# EasyEDA Pro project ayabinterfacev2.epro

# Board PCB1
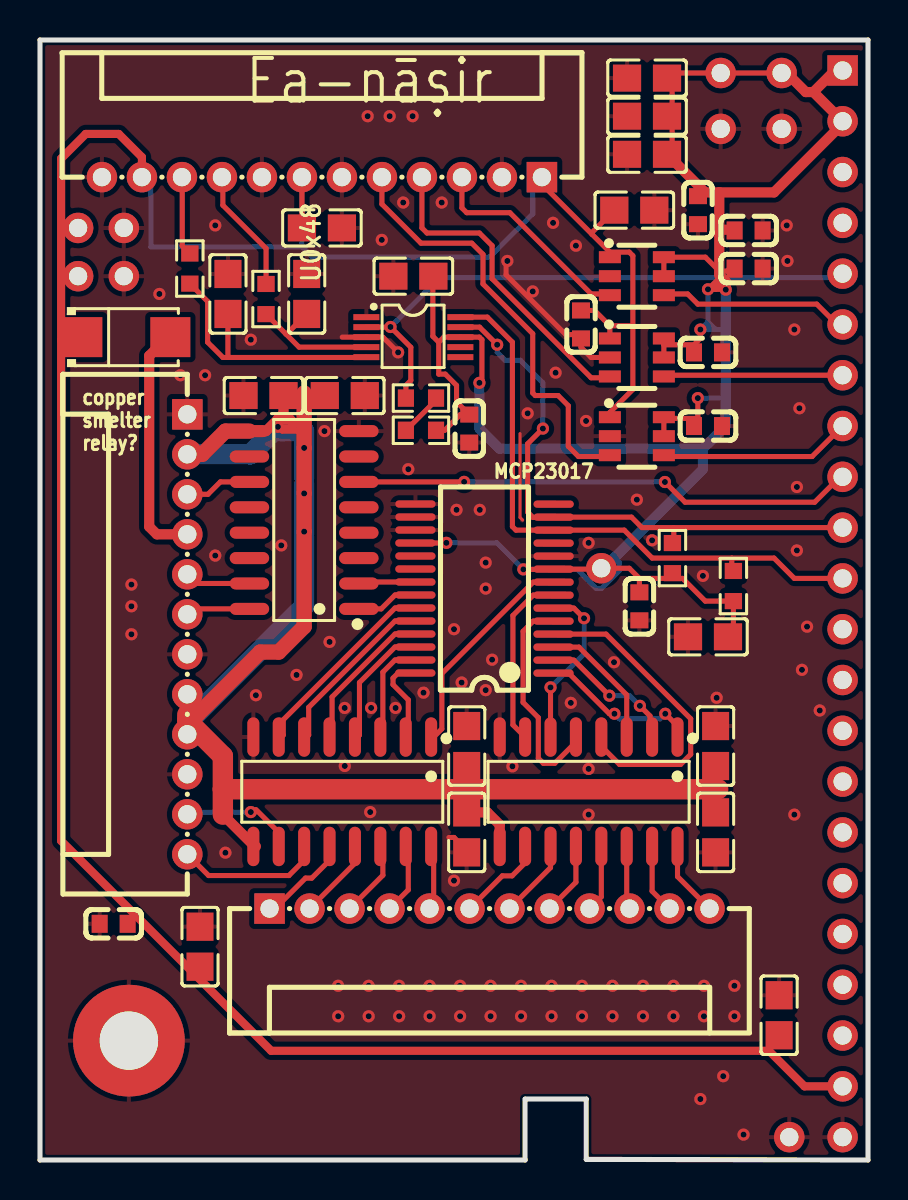
[diagram p0: board, top side]
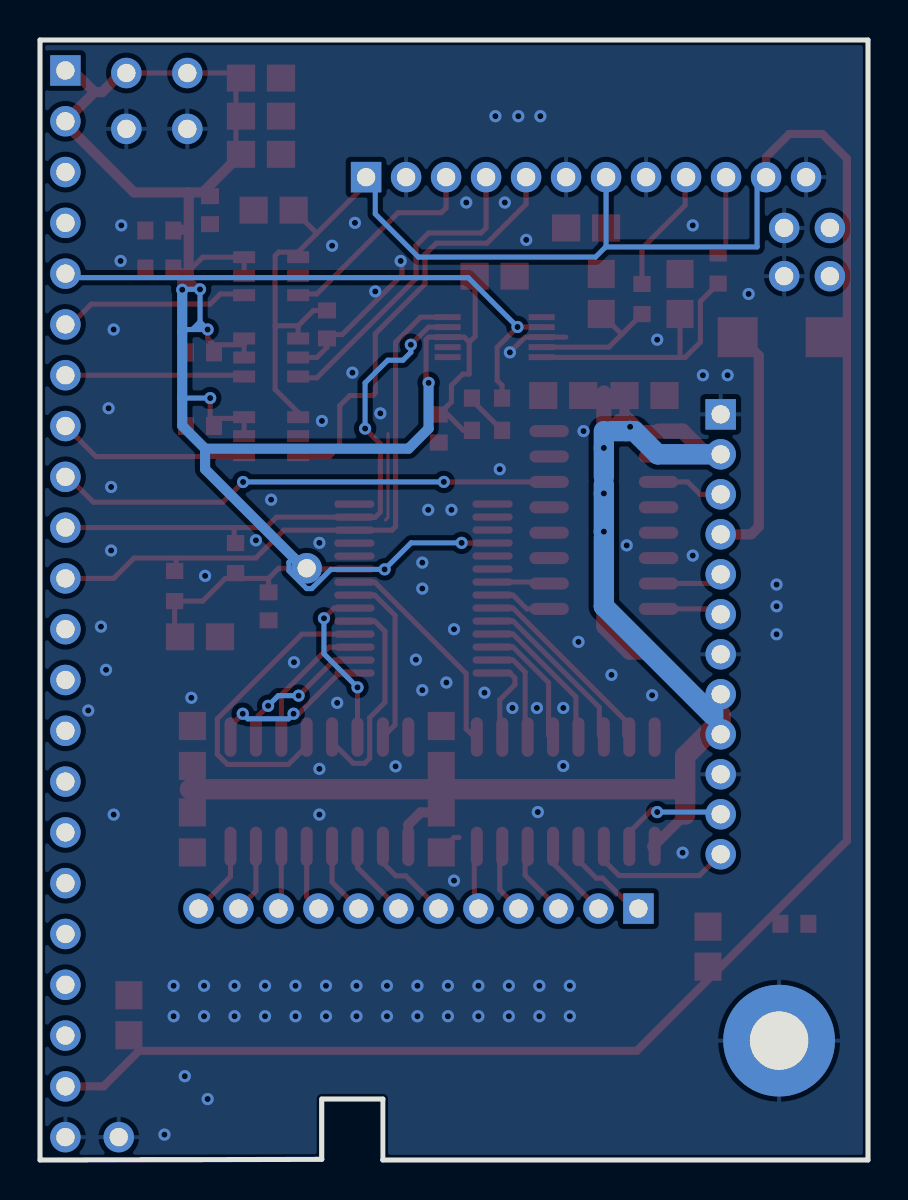
[diagram p1: board, bottom side, seen from below]

Outline 41.4 x 56.01 mm; copper layers: Top Layer, Bottom Layer. Coordinates in mm from the lower left corner of the outline.
Outline path: 0,56.01 0,0 24.26,0 24.26,3.05 27.31,3.05 27.31,0.03 41.4,0 41.4,56.01 0,56.01
Stack: Top Layer 0.035mm / Dielectric1 1.51mm FR4 er 4.5 / Bottom Layer 0.035mm

## Design rules (mm)
template: JLCPCB Capability(Two Layers Board)
spacing copperThickness1oz (default): track to track 0.102, other pairs 0.152 to 0.3
spacing copperThickness2oz: track to track 0.203, other pairs 0.152 to 0.3
track width copperThickness1oz (default): min 0.127, default 0.254, max 2.54
track width copperThickness2oz: min 0.203, default 0.254, max 2.54
differential pair differentialPair (default): width min 0.127, default 0.254, max 2.54; gap min 0.152, default 0.152
via viaSize (default): diameter min 0.5, default 0.61, max 10; hole min 0.3, default 0.305, max 6.3

## Placement (name value [footprint] x y rotation side)
C1  4.7nF  [C0805]  9.4 43.31 90 top
C2  4.7nF  [C0805]  13.33 43.31 90 top
C3  22uF  [C0805]  30.35 54.1 0 top
C4  22uF  [C0805]  30.35 52.2 0 top
C5  22uF  [C0805]  30.35 50.29 0 top
C6  22uF  [C0805]  18.67 44.2 0 top
C7  22uF  [C0805]  33.4 26.16 0 top
C8  22uF  [C0805]  14.1 46.61 180 top
C9  22uF  [C0805]  36.96 7.24 270 top
C10  22uF  [C0805]  29.72 47.5 180 top
C11  22uF  [C0805]  8 10.67 270 top
C12  100nF  [C0603]  32.9 47.5 90 top
C13  100nF  [C0603]  27.05 41.78 90 top
C14  100nF  [C0603]  21.46 36.58 90 top
C15  100nF  [C0603]  29.97 27.69 90 top
C16  100nF  [C0603]  35.43 46.48 180 top
C17  100nF  [C0603]  33.4 36.7 180 top
C18  100nF  [C0603]  35.43 44.58 180 top
C19  100nF  [C0603]  3.68 11.81 180 top
C20  100nF  [C0603]  33.4 40.39 180 top
C91  10uF  [C0805]  21.34 20.7 90 top
C92  10uF  [C0805]  21.34 16.38 90 top
C93  10uF  [C0805]  33.78 16.38 90 top
C94  10uF  [C0805]  33.78 20.7 90 top
C95  10uF  [C0805]  11.18 38.23 180 top
C96  10uF  [C0805]  15.24 38.23 0 top
D1  SS34  [SMA_L4.3-W2.6-LS5.2-RD]  4.32 41.15 0 top
j1  ZX-PH2.0-WZ12P  [CONN-TH_12P-P2.00_ZX-PH2.0-WZ12P]  7.37 26.29 270 top
j2  ZX-PH2.0-WZ12P  [CONN-TH_12P-P2.00_ZX-PH2.0-WZ12P]  14.1 49.15 180 top
j3  ZX-PH2.0-WZ12P  [CONN-TH_12P-P2.00_ZX-PH2.0-WZ12P]  22.48 12.57 0 top
MCP23017  MCP23017T-E/SS  [SSOP-28_L10.2-W5.3-P0.65-LS7.8-BL]  22.22 28.58 90 top
NOREF  -  [Pad_e4057]  28.07 29.59 0 top
NOREF#2  -  [Pad_e4377]  40.13 8.76 0 top
NOREF#3  -  [Pad_e4386]  40.13 31.62 0 top
NOREF#4  -  [Pad_e4382]  40.13 21.46 0 top
NOREF#5  -  [Pad_e4390]  40.13 41.78 0 top
NOREF#6  -  [Pad_e4378]  40.13 11.3 0 top
NOREF#7  -  [Pad_e965]  4.44 5.97 0 top
NOREF#8  -  [Pad_e4393]  40.13 49.4 0 top
NOREF#9  -  [Pad_e4379]  40.13 13.84 0 top
NOREF#10  -  [Pad_e4380]  40.13 16.38 0 top
NOREF#11  -  [Pad_e4373]  40.13 1.14 0 top
NOREF#12  -  [Pad_e4385]  40.13 29.08 0 top
NOREF#13  -  [Pad_e4384]  40.13 26.54 0 top
NOREF#14  -  [Pad_e4395]  40.13 54.48 0 top
NOREF#15  -  [Pad_e6798]  34.04 54.36 0 top
NOREF#16  -  [Pad_e3515]  37.08 54.36 0 top
NOREF#17  -  [Pad_e6799]  34.04 51.56 0 top
NOREF#18  -  [Pad_e4392]  40.13 46.86 0 top
NOREF#19  -  [Pad_e6248]  1.91 44.2 0 top
NOREF#20  -  [Pad_e4375]  40.13 3.68 0 top
NOREF#21  -  [Pad_e4394]  40.13 51.94 0 top
NOREF#22  -  [Pad_e4389]  40.13 39.24 0 top
NOREF#23  -  [Pad_e4376]  40.13 6.22 0 top
NOREF#24  -  [Pad_e4381]  40.13 18.92 0 top
NOREF#25  -  [Pad_e6250]  4.19 44.2 0 top
NOREF#26  -  [Pad_e4461]  37.08 51.56 0 top
NOREF#27  -  [Pad_e4241]  37.46 1.14 0 top
NOREF#28  -  [Pad_e4388]  40.13 36.7 0 top
NOREF#29  -  [Pad_e6249]  4.19 46.61 0 top
NOREF#30  -  [Pad_e6244]  1.91 46.61 0 top
NOREF#31  -  [Pad_e4387]  40.13 34.16 0 top
NOREF#32  -  [Pad_e4383]  40.13 24 0 top
NOREF#33  -  [Pad_e4391]  40.13 44.32 0 top
R1  4.7kΩ  [R0603]  7.49 44.58 90 top
R2  4.7kΩ  [R0603]  11.3 43.05 90 top
R3  4.7kΩ  [R0603]  19.05 36.49 0 top
R4  4.7kΩ  [R0603]  19.05 38.1 0 top
R5  4.7kΩ  [R0603]  34.67 28.7 90 top
R6  4.7kΩ  [R0603]  31.62 30.1 90 top
U0x48  ADS1015IDGSR  [VSSOP-10_L3.0-W3.0-P0.50-LS4.9-BL]  18.67 41.15 270 top
U2  ULN2003ADR  [SOIC-16_L9.9-W3.9-P1.27-LS6.0-BL]  13.21 32 90 top
U4  ULN2003ADR  [SOIC-16_L9.9-W3.9-P1.27-LS6.0-BL]  15.11 18.42 180 top
U5  SN74LVC1T45DBVR  [SOT-23-6_L2.9-W1.6-P0.95-LS2.8-BR]  29.84 36.19 180 top
U6  SN74LVC1T45DBVR  [SOT-23-6_L2.9-W1.6-P0.95-LS2.8-BR]  29.84 40.13 180 top
U7  SN74LVC1T45DBVR  [SOT-23-6_L2.9-W1.6-P0.95-LS2.8-BR]  29.84 44.2 180 top
U14  ULN2003ADR  [SOIC-16_L9.9-W3.9-P1.27-LS6.0-BL]  27.43 18.42 180 top

## Footprints (pads in the part's own frame, mm; a bottom-side part is the same pattern mirrored in y, then rotated)
C0603
  rect 0.8x0.9 smd: 1(-0.7,0) 2(0.7,0)
C0805
  rect 1.41x1.35 smd: 1(-1,0) 2(1,0)
CONN-TH_12P-P2.00_ZX-PH2.0-WZ12P
  rect 1.524x1.524 hole 0.914: 1(-11,0)
  round 1.524 hole 0.914: 2(-9,0) 3(-7,0) 4(-5,0) 5(-3,0) 6(-1,0) 7(1,0) 8(3,0) 9(5,0) 10(7,0) 11(9,0) 12(11,0)
Pad_e965
  round 5.588 hole 2.921: 1(0,0)
Pad_e3515
  round 1.524 hole 0.914: 1(0,0)
Pad_e4057
  round 1.524 hole 0.914: 1(0,0)
Pad_e4241
  round 1.524 hole 0.914: 1(0,0)
Pad_e4373
  round 1.524 hole 0.914: 1(0,0)
Pad_e4375
  round 1.524 hole 0.914: 1(0,0)
Pad_e4376
  round 1.524 hole 0.914: 1(0,0)
Pad_e4377
  round 1.524 hole 0.914: 1(0,0)
Pad_e4378
  round 1.524 hole 0.914: 1(0,0)
Pad_e4379
  round 1.524 hole 0.914: 1(0,0)
Pad_e4380
  round 1.524 hole 0.914: 1(0,0)
Pad_e4381
  round 1.524 hole 0.914: 1(0,0)
Pad_e4382
  round 1.524 hole 0.914: 1(0,0)
Pad_e4383
  round 1.524 hole 0.914: 1(0,0)
Pad_e4384
  round 1.524 hole 0.914: 1(0,0)
Pad_e4385
  round 1.524 hole 0.914: 1(0,0)
Pad_e4386
  round 1.524 hole 0.914: 1(0,0)
Pad_e4387
  round 1.524 hole 0.914: 1(0,0)
Pad_e4388
  round 1.524 hole 0.914: 1(0,0)
Pad_e4389
  round 1.524 hole 0.914: 1(0,0)
Pad_e4390
  round 1.524 hole 0.914: 1(0,0)
Pad_e4391
  round 1.524 hole 0.914: 1(0,0)
Pad_e4392
  round 1.524 hole 0.914: 1(0,0)
Pad_e4393
  round 1.524 hole 0.914: 1(0,0)
Pad_e4394
  round 1.524 hole 0.914: 1(0,0)
Pad_e4395
  rect 1.524x1.524 hole 0.914: 1(0,0)
Pad_e4461
  round 1.524 hole 0.914: 1(0,0)
Pad_e6244
  round 1.524 hole 0.914: 1(0,0)
Pad_e6248
  round 1.524 hole 0.914: 1(0,0)
Pad_e6249
  round 1.524 hole 0.914: 2(0,0)
Pad_e6250
  round 1.524 hole 0.914: 3(0,0)
Pad_e6798
  round 1.524 hole 0.914: 1(0,0)
Pad_e6799
  round 1.524 hole 0.914: 1(0,0)
R0603
  rect 0.806x0.864 smd: 1(-0.753,0) 2(0.753,0)
SMA_L4.3-W2.6-LS5.2-RD
  rect 2x2 smd: 1(-2.2,0) 2(2.2,0)
SOIC-16_L9.9-W3.9-P1.27-LS6.0-BL
  oval 0.602x1.971 smd: 1(-4.445,-2.736) 2(-3.175,-2.736) 3(-1.905,-2.736) 4(-0.635,-2.736) 5(0.635,-2.736) 6(1.905,-2.736) 7(3.175,-2.736) 8(4.445,-2.736) 9(4.445,2.736) 10(3.175,2.736) 11(1.905,2.736) 12(0.635,2.736) 13(-0.635,2.736) 14(-1.905,2.736) 15(-3.175,2.736) 16(-4.445,2.736)
SOT-23-6_L2.9-W1.6-P0.95-LS2.8-BR
  rect 1.1x0.6 smd: 1(1.35,-0.95) 2(1.35,0) 3(1.35,0.95) 4(-1.35,0.95) 5(-1.35,0) 6(-1.35,-0.95)
SSOP-28_L10.2-W5.3-P0.65-LS7.8-BL
  oval 0.364x2.015 smd: 1(-4.225,-3.455) 2(-3.575,-3.455) 3(-2.925,-3.455) 4(-2.275,-3.455) 5(-1.625,-3.455) 6(-0.975,-3.455) 7(-0.325,-3.455) 8(0.325,-3.455) 9(0.975,-3.455) 10(1.625,-3.455) 11(2.275,-3.455) 12(2.925,-3.455) 13(3.575,-3.455) 14(4.225,-3.455) 15(4.225,3.455) 16(3.575,3.455) 17(2.925,3.455) 18(2.275,3.455) 19(1.625,3.455) 20(0.975,3.455) 21(0.325,3.455) 22(-0.325,3.455) 23(-0.975,3.455) 24(-1.625,3.455) 25(-2.275,3.455) 26(-2.925,3.455) 27(-3.575,3.455) 28(-4.225,3.455)
VSSOP-10_L3.0-W3.0-P0.50-LS4.9-BL
  rect 0.3x1.3 smd: 1(-1,-2.35) 2(-0.5,-2.35) 3(0,-2.35) 4(0.5,-2.35) 5(1,-2.35) 6(1,2.35) 7(0.5,2.35) 8(0,2.35) 9(-0.5,2.35) 10(-1,2.35)

## Nets
+3V3: C3.2 C4.2 C5.2 C6.2 C7.2 C12.2 C14.2 C15.2 C16.2 C17.2 C18.2 C20.2 MCP23017.9 MCP23017.18 NOREF.1 NOREF#14.1 NOREF#15.1 NOREF#16.1 NOREF#21.1 R3.2 R5.1 R6.1 U0x48.8 U5.5 U5.6 U6.5 U6.6 U7.5 U7.6
+5V: C8.2 C9.2 C10.2 C11.2 C13.2 C19.1 D1.1 j2.1 j2.7 j2.11 NOREF#19.1 NOREF#20.1 NOREF#30.1 U5.1 U6.1 U7.1
+5VCON: D1.2 j1.4
+12V: C91.1 C92.2 C93.2 C94.1 C95.1 C96.1 j1.2 j1.8 j1.9 U2.9 U4.9 U14.9
GND: C1.2 C2.2 C3.1 C4.1 C5.1 C6.1 C7.1 C8.1 C9.1 C10.1 C11.1 C12.1 C13.1 C14.1 C15.1 C16.1 C17.1 C18.1 C19.2 C20.1 C91.2 C92.1 C93.1 C94.2 C95.2 C96.2 j1.1 j1.7 j1.10 j2.2 j2.6 j2.8 j2.12 MCP23017.10 MCP23017.15 MCP23017.16 MCP23017.17 NOREF#7.1 NOREF#11.1 NOREF#17.1 NOREF#25.3 NOREF#26.1 NOREF#27.1 NOREF#29.2 U0x48.1 U0x48.3 U2.8 U4.8 U5.2 U6.2 U7.2 U14.8
3BPR: NOREF#28.1 U5.4
3E1R: NOREF#22.1 U6.4
3E2R: NOREF#5.1 U7.4
/AUX-CONNECTORS/AYAB_SCL: MCP23017.12 NOREF#12.1 R5.2 U0x48.10
/AUX-CONNECTORS/AYAB_SDA: MCP23017.13 NOREF#3.1 R6.2 U0x48.9
/BROTHER-CONNECTORS/ENC_BELTPHASERES: j2.5 U5.3
/BROTHER-CONNECTORS/ENC_V1RES: j2.4 U6.3
/BROTHER-CONNECTORS/ENC_V2RES: j2.3 U7.3
/BROTHER-CONNECTORS/EOL_L: C1.1 R1.1 U0x48.5
/BROTHER-CONNECTORS/EOL_LRES: j2.10 R1.2
/BROTHER-CONNECTORS/EOL_R: C2.1 R2.1 U0x48.4
/BROTHER-CONNECTORS/EOL_RRES: j2.9 R2.2
/BROTHER-CONNECTORS/SOL_0: j3.5 U4.16
/BROTHER-CONNECTORS/SOL_1: j3.6 U14.10
/BROTHER-CONNECTORS/SOL_2: j3.7 U14.11
/BROTHER-CONNECTORS/SOL_3: j3.8 U14.12
/BROTHER-CONNECTORS/SOL_4: j3.9 U14.13
/BROTHER-CONNECTORS/SOL_5: j3.10 U14.14
/BROTHER-CONNECTORS/SOL_6: j3.11 U14.15
/BROTHER-CONNECTORS/SOL_7: j3.12 U14.16
/BROTHER-CONNECTORS/SOL_8: j1.5 U2.15
/BROTHER-CONNECTORS/SOL_9: j1.6 U2.16
/BROTHER-CONNECTORS/SOL_A: j1.11 U4.10
/BROTHER-CONNECTORS/SOL_B: j1.12 U4.11
/BROTHER-CONNECTORS/SOL_C: j3.1 U4.12
/BROTHER-CONNECTORS/SOL_D: j3.2 U4.13
/BROTHER-CONNECTORS/SOL_E: j3.3 U4.14
/BROTHER-CONNECTORS/SOL_F: j3.4 U4.15
/SOLENOID DRIVERS/MCU_SOL_0: MCP23017.8 U4.1
/SOLENOID DRIVERS/MCU_SOL_1: MCP23017.7 U14.7
/SOLENOID DRIVERS/MCU_SOL_2: MCP23017.6 U14.6
/SOLENOID DRIVERS/MCU_SOL_3: MCP23017.5 U14.5
/SOLENOID DRIVERS/MCU_SOL_4: MCP23017.4 U14.4
/SOLENOID DRIVERS/MCU_SOL_5: MCP23017.3 U14.3
/SOLENOID DRIVERS/MCU_SOL_6: MCP23017.2 U14.2
/SOLENOID DRIVERS/MCU_SOL_7: MCP23017.1 U14.1
/SOLENOID DRIVERS/MCU_SOL_8: MCP23017.21 U2.2
/SOLENOID DRIVERS/MCU_SOL_9: MCP23017.22 U2.1
/SOLENOID DRIVERS/MCU_SOL_A: MCP23017.23 U4.7
/SOLENOID DRIVERS/MCU_SOL_B: MCP23017.24 U4.6
/SOLENOID DRIVERS/MCU_SOL_C: MCP23017.25 U4.5
/SOLENOID DRIVERS/MCU_SOL_D: MCP23017.26 U4.4
/SOLENOID DRIVERS/MCU_SOL_E: MCP23017.27 U4.3
/SOLENOID DRIVERS/MCU_SOL_F: MCP23017.28 U4.2
BUZZER: NOREF#31.1 U2.6
BUZZER12V: j1.3 U2.11
I2CALERT: NOREF#33.1 R4.1 U0x48.2
JIM: R3.1 R4.2

Pads without a net: MCP23017 11 14 19 20; NOREF#2 1; NOREF#4 1; NOREF#6 1; NOREF#8 1; NOREF#9 1; NOREF#10 1; NOREF#13 1; NOREF#18 1; NOREF#23 1; NOREF#24 1; NOREF#32 1; U0x48 6 7; U2 3 4 5 7 10 12 13 14

## Via types
v1: diameter 0.61, hole 0.305, Top Layer to Bottom Layer, 119 vias

## Routing (per net, layer and track width the routed paths; a pad name or vN(x,y) marks a point on that pad's centre or on a via; arc(x,y) is an arc through that point)
+3V3: length 124.1
  Top Layer w0.254: 29.97,29.08 32.13,29.08 33.27,27.95 R5.1 34.67,26.43 C7.2 ; 29.97,29.08 C15.2 ; 29.97,29.08 29.46,29.59 28.19,29.59 ; U6.5 31.19,40.77 ; 31.19,40.77 32.7,40.77 33.02,41.09 v1(33.02,41.53) ; 31.19,40.77 U6.6 ; 19.64,44.21 19.64,41.19 19.94,40.89 ; 33.99,43.81 33.79,43.61 33.79,43.54 ; 33.99,43.81 34.27,43.54 ; 33.99,43.81 33.78,43.81 ; U5.6 31.19,37.08 ; 31.19,37.08 U5.5 ; 31.19,37.08 32.83,37.08 32.89,37.15 v1(32.89,38.1) ; 19.94,40.89 20.19,41.15 U0x48.8 21.97,41.15 22.1,41.02 22.1,38.99 v1(21.97,38.86) ; 19.94,40.89 19.94,39.3 20.26,39.3 20.83,38.73 20.83,37.91 C14.2 21.02,37.28 20.23,36.49 R3.2 ; 34.27,43.54 33.79,43.54 ; 34.27,43.54 v1(34.29,43.52) ; 33.79,43.54 v1(33.4,43.54) 33.91,44.05 33.91,44.07 ; NOREF.1 28.19,29.59 ; 28.19,29.59 28.15,29.55 MCP23017.9 25.67,29.53 v1(24.17,29.53) ; v1(20.32,30.86) 20.31,30.85 MCP23017.18 ; NOREF#16.1 NOREF#15.1 31.73,54.36 31.61,54.48 31.61,50.41 ; U7.5 U7.6 33.27,45.15 33.96,44.45 34.35,44.45 34.48,44.58
  Top Layer w0.508: 33.96,46.52 33.96,44.26 34.29,43.93 v1(34.29,43.52) ; 33.96,46.52 33.96,48.39 ; 33.96,46.52 34.7,46.52 C16.2 ; 33.96,48.39 36.7,48.39 40.13,51.82 NOREF#21.1 38.67,53.4 ; 33.96,48.39 33.26,48.39 C5.2 ; 38.67,53.4 38.29,53.4 37.08,54.61 ; 38.67,53.4 39.75,54.48 NOREF#14.1
  Bottom Layer w0.254: v1(20.32,30.86) 22.85,30.86 v1(24.17,29.53) 26.85,29.53 27.81,28.58 28.07,28.58 28.96,29.46 28.96,29.89 28.72,30.12 ; v1(32.89,38.1) 34.25,38.1 34.29,38.14 ; 33.42,41.53 v1(33.02,41.53) 33.4,41.91 ; 33.42,41.53 33.73,41.53 ; 33.42,41.53 33.4,41.55 33.4,41.91 ; 34.29,41.4 34.16,41.53 33.73,41.53 ; 33.73,41.53 33.73,41.58 33.4,41.91 ; 33.4,41.91 v1(33.4,43.54) 34.27,43.54 v1(34.29,43.52)
  Bottom Layer w0.508: 33.15,35.57 22.97,35.57 21.97,36.58 21.97,38.61 ; 33.15,35.57 34.29,36.72 v1(34.29,43.52) ; 33.15,35.57 33.15,34.54 28.19,29.59
+5V: length 137.9
  Top Layer w0.254: j2.1 25.1,48.8 27.6,46.29 ; 27.6,46.29 27.6,46.38 C10.2 ; 27.6,46.29 28.49,45.4 29.46,45.4 29.64,45.22 29.64,41.72 ; 28.49,37.02 28.49,37.39 29.64,38.53 29.64,41.72 ; 29.64,41.72 29.64,41.72 28.49,41.72 ; 28.49,41.72 27.73,42.48 C13.2 ; 28.49,41.72 U6.1 ; 13.1,46.86 j2.7
  Top Layer w0.406: 1.06,40.99 2.14,40.99 2.3,41.15 ; 1.06,40.99 1.06,15.96 11.56,5.46 36.45,5.46 38.23,3.68 NOREF#20.1 ; 1.06,40.99 1.06,50.08 2.29,51.31 3.94,51.31 5.1,50.15 j2.11
  Bottom Layer w0.254: 13.12,45.66 13.63,45.15 22.48,45.15 24.64,47.31 24.64,49.65 ; 13.12,45.66 13.1,45.68 j2.7 ; 13.12,45.66 5.55,45.66 5.55,48.7 j2.11
+5VCON: length 11.9
  Top Layer w0.508: j1.4 5.84,31.29 5.46,31.67 5.46,40.22 6.39,41.15
+12V: length 89.8
  Top Layer w0.254: 12.61,36.66 12.83,36.45 12.11,36.45 v1(11.89,36.66) 12.61,36.66
  Top Layer w0.508: 11.9,37.04 11.3,36.45 U2.9 ; 11.9,37.04 12.18,37.32 C95.1 ; 11.9,37.04 12.49,37.04 12.7,36.83 ; C92.2 22.37,17.38 22.99,16.76 U14.9 ; 9.14,17.27 10.74,15.68 10.79,15.68
  Top Layer w0.762: 13.21,38.35 v1(13.21,35.61) v1(13.21,33.33) v1(13.21,31.42) 13.21,26.67 11.94,25.4 11.01,25.4 7.87,22.26 7.37,22.26 j1.8 ; U2.9 9.27,36.45 8.11,35.29 j1.2
  Top Layer w1.016: 9.14,18.54 9.14,20.19 7.37,21.97 7.37,22.26 ; 9.14,18.54 9.14,17.27 ; 9.14,18.54 33.91,18.54
  Bottom Layer w0.254: j1.8 j1.9 ; 12.11,36.45 v1(11.89,36.66)
  Bottom Layer w1.016: 13.21,34.16 v1(13.21,35.61) 13.21,36.45 ; 13.21,33.78 v1(13.21,33.33) v1(13.21,31.42) 13.21,31.37 ; 7.75,22.22 13.21,27.69 13.21,31.11 ; j1.2 10.52,35.29 11.68,36.45 12.83,36.45
GND: length 16.6
  Top Layer w0.152: 24.13,32 24,32.13 24,36.32
  Top Layer w0.254: 15.11,41.15 U0x48.3 17.14,41.15 v1(17.91,40.39) ; v1(23.37,44.96) 23.3,44.89 23.3,44.26 26.29,41.28 26.86,41.28 C13.1 27.05,40.64 27.56,40.13 U6.2 ; C92.1 21.34,15.49 20.7,16.13 20.45,16.13
  vias: v1(4.57,28.78) v1(4.57,27.69) v1(4.57,26.29) v1(5.97,43.31) v1(7.02,39.24) v1(8.25,39.24) v1(8.76,46.74) v1(8.76,30.23) v1(9.27,15.37) v1(10.54,41.02) v1(10.79,23.24) v1(12.06,30.73) v1(12.83,24.26) v1(14.22,36.45) v1(14.48,25.91) v1(14.91,8.71) v1(14.91,7.19) v1(15.24,22.61) v1(15.24,19.7) v1(16.38,52.2) v1(16.51,17.4) v1(16.43,8.71) v1(16.43,7.19) v1(16.56,22.61) v1(17.09,46.01) v1(17.48,52.2) v1(17.78,22.61) v1(17.96,8.71) v1(17.96,7.19) v1(18.16,47.88) v1(18.41,34.54) v1(18.63,52.2) v1(19.18,23.37) v1(19.48,8.71) v1(19.48,7.19) v1(20.09,47.88) v1(20.7,26.54) v1(20.7,13.97) v1(20.83,32.51) v1(21.01,8.71) v1(21.01,7.19) v1(21.08,23.88) v1(21.99,32.51) v1(22.29,29.87) v1(22.29,28.58) v1(22.29,23.5) v1(22.61,25.02) v1(22.53,8.71) v1(22.53,7.19) v1(23.62,19.69) v1(24.05,8.71) v1(24.05,7.19) v1(24.38,37.34) v1(24.64,43.43) v1(25.58,8.71) v1(25.58,7.19) v1(25.65,46.86) v1(25.78,39.37) v1(26.54,22.86) v1(26.8,45.72) v1(27.1,8.71) v1(27.1,7.19) v1(27.3,36.96) v1(27.43,30.86) v1(27.43,19.56) v1(27.43,17.27) v1(28.7,24.89) v1(28.63,8.71) v1(28.63,7.19) v1(29.84,33.02) v1(30.15,8.71) v1(30.15,7.19) v1(30.61,30.99) v1(31.67,8.71) v1(31.67,7.19) v1(33.02,3.05) v1(33.15,29.21) v1(33.2,8.71) v1(33.2,7.19) v1(33.83,23.11) v1(34.16,4.19) v1(34.72,8.71) v1(34.72,7.19) v1(35.18,1.27) v1(37.34,46.74) v1(37.37,44.96) v1(37.72,41.53) v1(37.72,17.27) v1(37.85,33.66) v1(37.85,30.48) v1(37.97,37.59) v1(38.1,24.51) v1(38.35,26.67) v1(38.99,22.48)
3BPR: length 9.6
  Top Layer w0.254: NOREF#28.1 38.61,35.18 31.26,35.18 31.19,35.12
3E1R: length 9
  Top Layer w0.254: U6.4 31.26,39.24 NOREF#22.1
3E2R: length 9.5
  Top Layer w0.254: NOREF#5.1 39.85,41.78 38.84,42.8 32.89,42.8 32.38,43.31 31.26,43.31
/AUX-CONNECTORS/AYAB_SCL: length 30.6
  Top Layer w0.254: NOREF#12.1 37.72,29.08 36.7,30.1 34.59,30.1 ; R5.2 34.59,29.53 34.59,30.1 ; 34.59,30.1 30.61,30.1 29.21,31.5 MCP23017.12 23.8,31.5 23.62,31.67 23.62,40.89 22.37,42.15 U0x48.10
/AUX-CONNECTORS/AYAB_SDA: length 29
  Top Layer w0.254: 31.69,31.62 NOREF#3.1 ; 31.69,31.62 30.1,31.62 29.57,32.15 MCP23017.13 25.67,32.13 24.65,32.13 24.38,32.4 24.38,35.81 v1(25.15,36.58) ; 31.69,31.62 31.69,31.03 ; U0x48.9 21.98,41.65 v1(22.86,40.77)
  Bottom Layer w0.254: v1(25.15,36.58) 25.15,38.86 24.01,40 23.25,40 22.86,40.39 v1(22.86,40.77)
/BROTHER-CONNECTORS/ENC_BELTPHASERES: length 21.7
  Top Layer w0.254: j2.5 17.1,47.8 19.05,45.85 21.59,45.85 22.15,45.29 22.15,43.81 24.64,41.32 24.64,38.35 24.76,38.23 25.91,38.23 26.42,37.72 26.42,35.69 26.92,35.18 28.45,35.18
/BROTHER-CONNECTORS/ENC_V1RES: length 15.6
  Top Layer w0.254: 28.06,39.12 27.56,39.12 22.61,44.07 22.61,45.72 21.97,46.36 19.35,46.36 19.1,46.61 j2.4
/BROTHER-CONNECTORS/ENC_V2RES: length 10.5
  Top Layer w0.254: j2.3 21.1,47.61 21.34,47.37 23.49,47.37 27.56,43.31 28.3,43.31
/BROTHER-CONNECTORS/EOL_L: length 14
  Top Layer w0.254: 9.41,40.13 9.4,40.14 9.4,42.56 ; 9.41,40.13 9.14,40.13 8.38,40.89 8.38,42.93 R1.1 ; 9.41,40.13 16.3,40.13 U0x48.5
/BROTHER-CONNECTORS/EOL_LRES: length 4
  Top Layer w0.254: j2.10 7.11,49.13 7.11,45.71 R1.2
/BROTHER-CONNECTORS/EOL_R: length 7.2
  Top Layer w0.254: 12.3,41.3 12.33,41.3 C2.1 ; 12.3,41.3 R2.1 ; 12.3,41.3 12.95,40.65 U0x48.4
/BROTHER-CONNECTORS/EOL_RRES: length 6.3
  Top Layer w0.254: R2.2 11.3,45.58 9.14,47.74 9.14,49.1 j2.9
/BROTHER-CONNECTORS/SOL_0: length 3.2
  Top Layer w0.254: j3.5 19.69,12.78 19.69,15.68
/BROTHER-CONNECTORS/SOL_1: length 4.5
  Top Layer w0.254: U14.10 24.26,14.86 23.61,14.21 23.11,14.21 j3.6
/BROTHER-CONNECTORS/SOL_2: length 4
  Top Layer w0.254: U14.11 25.53,14.62 j3.7
/BROTHER-CONNECTORS/SOL_3: length 3.7
  Top Layer w0.254: U14.12 26.8,13.89 j3.8
/BROTHER-CONNECTORS/SOL_4: length 3.4
  Top Layer w0.254: j3.9 28.07,13.16 U14.13
/BROTHER-CONNECTORS/SOL_5: length 3.2
  Top Layer w0.254: j3.10 29.34,12.72 U14.14
/BROTHER-CONNECTORS/SOL_6: length 3.5
  Top Layer w0.254: j3.11 30.61,13.44 U14.15
/BROTHER-CONNECTORS/SOL_7: length 3.8
  Top Layer w0.254: j3.12 31.88,14.17 U14.16
/BROTHER-CONNECTORS/SOL_8: length 3.3
  Top Layer w0.254: j1.5 7.83,28.83 U2.15
/BROTHER-CONNECTORS/SOL_9: length 3.2
  Top Layer w0.254: j1.6 7.64,27.56 U2.16
/BROTHER-CONNECTORS/SOL_A: length 5.6
  Top Layer w0.254: 10.79,17.53 12.06,16.26 12.06,15.68
  Bottom Layer w0.254: j1.11 7.48,17.4 v1(10.54,17.4)
/BROTHER-CONNECTORS/SOL_B: length 7.3
  Top Layer w0.254: 13.33,15.68 13.33,15.11 12.45,14.22 8.43,14.22 j1.12
/BROTHER-CONNECTORS/SOL_C: length 4.7
  Top Layer w0.254: 14.6,15.68 14.6,15.11 13.59,14.1 13.28,14.1 12.06,12.89 11.79,12.89 j3.1
/BROTHER-CONNECTORS/SOL_D: length 4.1
  Top Layer w0.254: 15.88,15.68 15.88,14.97 j3.2
/BROTHER-CONNECTORS/SOL_E: length 3.8
  Top Layer w0.254: 17.14,15.68 17.14,14.24 j3.3
/BROTHER-CONNECTORS/SOL_F: length 3.5
  Top Layer w0.254: 18.41,15.68 18.41,13.51 j3.4
/SOLENOID DRIVERS/MCU_SOL_0: length 10.8
  Top Layer w0.254: MCP23017.8 24.66,28.9 20.09,24.33 20.09,21.56 19.69,21.15
/SOLENOID DRIVERS/MCU_SOL_1: length 8.8
  Top Layer w0.254: MCP23017.7 24.66,28.25 23.65,27.23 23.65,21.76 U14.7
/SOLENOID DRIVERS/MCU_SOL_2: length 8.4
  Top Layer w0.254: v1(25.53,23.63) U14.6 ; v1(27.2,27.09) 26.7,27.6 MCP23017.6
  Bottom Layer w0.254: v1(25.53,23.63) 27.2,25.31 v1(27.2,27.09)
/SOLENOID DRIVERS/MCU_SOL_3: length 11.1
  Top Layer w0.254: MCP23017.5 24.66,26.95 24.16,26.44 24.16,22.88 24.92,22.12 24.92,20.09 25.17,19.83 25.74,19.83 26.75,20.85 26.75,21.11 U14.5
/SOLENOID DRIVERS/MCU_SOL_4: length 15.9
  Top Layer w0.254: MCP23017.4 28.3,26.3 32.54,22.06 32.54,20.29 32.03,19.78 28.98,19.78 28.07,20.69 U14.4
/SOLENOID DRIVERS/MCU_SOL_5: length 6.8
  Top Layer w0.254: U14.3 29.34,23.26 26.95,25.65 MCP23017.3
/SOLENOID DRIVERS/MCU_SOL_6: length 7.1
  Top Layer w0.254: MCP23017.2 26.69,25 v1(28.47,23.22) ; U14.2 30.61,21.79 30.5,21.89 30.5,22.2 v1(29.99,22.71)
  Bottom Layer w0.254: v1(29.99,22.71) 29.49,23.22 v1(28.47,23.22)
/SOLENOID DRIVERS/MCU_SOL_7: length 8.1
  Top Layer w0.254: v1(31.26,22.31) 31.88,21.7 U14.1 ; MCP23017.1 26.44,24.35 28.47,22.31 v1(28.72,22.31)
  Bottom Layer w0.254: v1(31.26,22.31) 31.01,22.06 28.98,22.06 v1(28.72,22.31)
/SOLENOID DRIVERS/MCU_SOL_8: length 2.9
  Top Layer w0.254: U2.2 16.02,28.9 MCP23017.21
/SOLENOID DRIVERS/MCU_SOL_9: length 3.1
  Top Layer w0.254: U2.1 17.06,27.56 17.75,28.25 MCP23017.22
/SOLENOID DRIVERS/MCU_SOL_A: length 9.8
  Top Layer w0.254: MCP23017.23 17.75,27.6 12.16,22.02 12.16,21.25 12.06,21.15
/SOLENOID DRIVERS/MCU_SOL_B: length 8.6
  Top Layer w0.254: 13.33,21.15 13.43,21.25 13.43,22.64 17.75,26.95 MCP23017.24
/SOLENOID DRIVERS/MCU_SOL_C: length 7.5
  Top Layer w0.254: 14.6,21.15 14.6,23.16 17.75,26.3 18.77,26.3
/SOLENOID DRIVERS/MCU_SOL_D: length 6.3
  Top Layer w0.254: 15.88,21.15 15.97,21.25 15.97,23.88 17.75,25.65 MCP23017.26
/SOLENOID DRIVERS/MCU_SOL_E: length 5.1
  Top Layer w0.254: MCP23017.27 17.75,25 17.14,24.4 17.14,21.15
/SOLENOID DRIVERS/MCU_SOL_F: length 4.5
  Top Layer w0.254: 18.41,21.15 18.41,23.01 17.65,23.77 17.65,24.1 17.91,24.35 MCP23017.28
BUZZER: length 25.1
  Top Layer w0.254: U2.6 v1(21.21,33.91) ; NOREF#31.1 40,34.16 38.73,32.89 32.26,32.89 v1(31.25,33.9)
  Bottom Layer w0.254: v1(31.25,33.9) 31.24,33.91 v1(21.21,33.91)
BUZZER12V: length 3.4
  Top Layer w0.254: j1.3 8.4,33.29 9.02,33.91 U2.11
I2CALERT: length 29
  Top Layer w0.254: U0x48.2 17.52,41.65 v1(17.53,41.66) 18.54,40.64 18.54,38.98 18.3,38.73 R4.1
  Bottom Layer w0.254: v1(17.53,41.66) 19.99,44.12 39.93,44.12 NOREF#33.1
JIM: length 2.1
  Top Layer w0.254: R3.1 19.69,37.88 19.69,37.98

## Copper pours and planes (outline as drawn; the poured copper is in the pictures)
GND on Top Layer: -17.91,68.45 91.69,68.45 91.69,-15.62 -17.91,-15.62
GND on Bottom Layer: -19.81,67.82 84.96,67.82 84.96,-10.29 -19.81,-10.29

## Text on the board
Top Silkscreen Layer: copper / smelter / relay? | Ea-nāṣir
